# Altium schematic sheet Sheet1.SchDoc
size 431 x 279 mm; SheetNumber: 1; SheetTotal: 1; ENG_APP_DATE: --/--/--; DSN_APP_DATE: --/--/--; CHK_APP_DATE: --/--/--
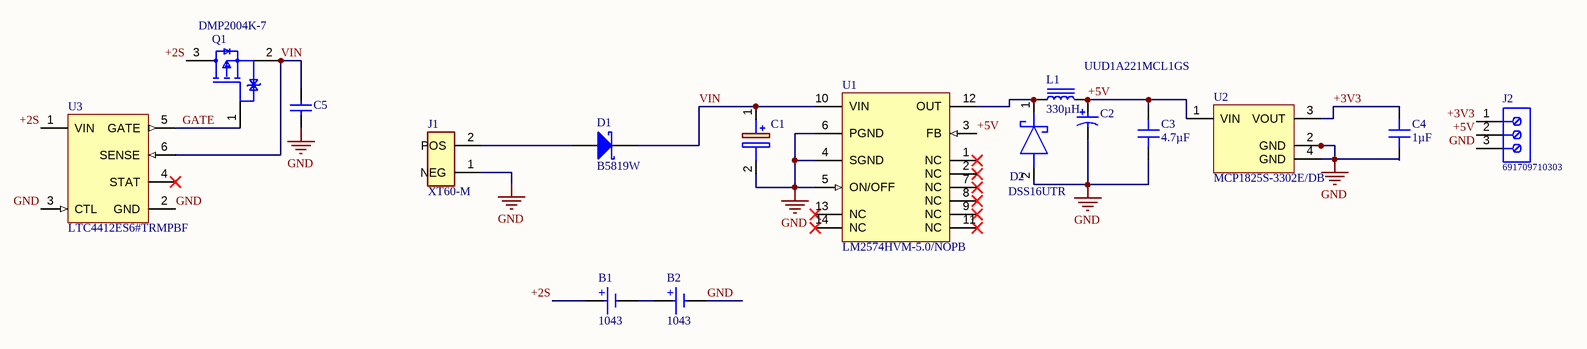
[diagram p0: Sheet1.SchDoc]

## Parts
B1  1043  [KEYSTONE 1043]
B2  1043  [KEYSTONE 1043]
C1  EMVH500ADA220MF80G  [CAPAE660X800N]  (value not drawn)
C2  UUD1A221MCL1GS  [NIC-CAPA2-6.3X7.7_V]
C3  4.7µF  [CAP 1206_3216 - 1.8MM]
C4  1µF  [CAP 1206_3216 - 1.8MM]
C5  C1206C105K5RACTU  [CAPC3216X110X50LL20T25]  (value not drawn)
D1  B5819W  [MCC-SOD123_V]
D2  DSS16UTR  [SODFL3618X110N]
J1  XT60-M  [AMASS_XT60-M]
J2  691709710303  [691709710303]
L1  330µH  [BOURNS SRR1280]
Q1  DMP2004K-7  [FP-SOT23-MFG]
U1  LM2574HVM-5.0/NOPB  [NPA0014B_L]
U2  MCP1825S-3302E/DB  [SOT-223-DB3_N]
U3  LTC4412ES6#TRMPBF  [LT-S6-6-TSOT-23_N]

## Nets
GND: B2.2(-) C1.2(-) C2.2 C3.1 C4.1 C5.1 D2.2(A) J1.1(NEG) J2.3 U1.4(SGND) U1.5(ON/OFF) U1.6(PGND) U2.2(GND) U2.4(GND) U3.2(GND) U3.3(CTL)
+2S: B1.1(+) Q1.3(D) U3.1(VIN)
+3V3: C4.2 J2.1 U2.3(VOUT)
+5V: C2.1 C3.2 J2.2 L1.2 U1.3(FB) U2.1(VIN)
GATE: Q1.1(G) U3.5(GATE)
VIN: C1.1(+) C5.2 D1.2(K) Q1.2(S) U1.10(VIN) U3.6(SENSE)
NetB1_2: B1.2(-) B2.1(+)
NetD1_1: D1.1(A) J1.2(POS)
NetD2_1: D2.1(K) L1.1 U1.12(OUT)

Not connected (* = marked no-connect by the designer): U1 1(NC)* 2(NC)* 7(NC)* 8(NC)* 9(NC)* 11(NC)* 13(NC)* 14(NC)*; U3 4(STAT)*

## Notes on the sheet
- DWG. NO.
- REV.
- SHT.
- THIS DOCUMENT AND THE DATA DISCLOSED HEREIN OR HEREWITH IS THE PROPERTY OF ALTIUM LIMITED AND MAY BE FREELY DISTRIBUTED IN WHOLE. NO RIGHTS ARE RESERVED OR EXPRESS OR IMPLIED WARANTEE GIVEN.
- REVISION
- DESCRIPTION
- DATE
- APPROVED
- ENG:
- APPROVALS
- PROJECT
- DSN:
- CHK:
- REFERENCE DOCUMENTS
- PROJECT REVISION:
- TITLE
- DOCUMENT REVISION:
- DESIGN ITEM:
- BOM:
- FAB DWG:
- PCB DWG:
- ASSY DWG:
- SCALE:
- SIZE
- B
- CAGE CODE
- FILE NAME
- DWG NO.
- SHEET
- OF
- REV

## Library data of the parts
B1 B2 = 1043: BATTERY HOLDER 18650 PC PIN; Manufacturer: Keystone Electronics; Battery Cell Size: 18650; Battery Type, Function: Cylindrical, Holder; Number of Cells: 1; Style: Holder (Open); Part Number: 1043; ComponentLink1Description: Datasheet; ComponentLink1URL: http://keyelco.com/userAssets/file/M65p27.pdf; ComponentLink2Description: DigiKey Link; ComponentLink2URL: http://digikey.com/product-detail/en/keystone-electronics/1043/36-1043-ND/2745669; Height Above Board: 0.585" (14.86mm); LastUpdated: 2/2/2020 9:19:56 AM; Lifecycle Status: Active; Minimum Order: 1; Mounting Type: PCB, Through Hole; Operating Temperature: -50°C ~ 145°C; Packaging: Unknown; PartId: 2; Part Status: Active; Price: 2.58; Series: -; Supplier 1: DigiKey; Supplier Part Number 1: 36-1043-ND; Termination Style: PC Pin
C1 = EMVH500ADA220MF80G: Capacitor Polarised; Manufacturer_Name: United Chemi-Con; Datasheet Link: https://eu.mouser.com/datasheet/2/420/MVHRA_e-2509159.pdf; Height: 8mm; Manufacturer_Part_Number: EMVH500ADA220MF80G; Mouser Part Number: 661-MVH50V220M; Mouser Price/Stock: https://www.mouser.co.uk/ProductDetail/United-Chemi-Con/EMVH500ADA220MF80G?qs=P6%252BCbgEIsoMIfZ3czqY2Bw%3D%3D; Arrow Part Number: EMVH500ADA220MF80G; Arrow Price/Stock: https://www.arrow.com/en/products/emvh500ada220mf80g/united-chemi-con
C2 = CMP-0687-00055-1: Aluminum Electrolytic Capacitor, UD Series, Low Impedance, 220 uF, 10 V, + / - 20%, -55 to 105 degC, Chip Type, 6.3 x 7.7 mm D x L, Pb-Free, Reel; Manufacturer: Nichicon; Packing: Dia382mm Reel; Tolerance Rated Capacitance: -20 to 20%; Impedance: 0.34 Ohm; Rated Ripple Current (at 100kHz): 280 mA; Rated Voltage: 10 V; Rated Capacitance: 220 uF; Endurance Time: 2000 h; RoHS: TRUE; ComponentLink1URL: http://www.nichicon.co.jp/; ComponentLink2Description: Datasheet; ComponentLink2URL: http://products.nichicon.co.jp/en/pdf/XJA043/e-ud.pdf; Mounting Technology: Surface Mount; PartNumber: UUD1A221MCL1GS; DatasheetVersion: 08/2012; ComponentLink3URL: http://products.nichicon.co.jp/en/pdf/XJA043/e-ud.pdf; ComponentLink3Description: Package Specification; PackageReference: CAPAE-D6.3H7.7; Diameter: 6.3 mm; PackageDescription: 2-Pin Surface Mount Device, Diameter 6.3 mm, Height 7.7 mm, Pitch 5.4 mm; Length: 7.7 mm; ComponentLink1Description: Manufacturer URL
C3 = CM316X5R475K25AT: CAP CER 4.7UF 25V X5R 1206; Manufacturer: Kyocera International Inc. Electronic Components; Tolerance: ±10%; Part Number: CM316X5R475K25AT; Value: 4.7µF; Applications: General Purpose; Capacitance: 4.7µF; ComponentLink1Description: Datasheet; ComponentLink1URL: https://global.kyocera.com/prdct/electro/product/pdf/cm_e.pdf; ComponentLink2Description: DigiKey Link; ComponentLink2URL: http://digikey.com/product-detail/en/kyocera-international-inc-electronic-components/CM316X5R475K25AT/1253-2080-1-ND/10197176; Device Package: 1206 (3216 Metric); LastUpdated: 9/2/2020 1:05:31 AM; Lifecycle Status: Active; Minimum Order: 1; Mounting Type: Surface Mount, MLCC; Operating Temperature: -55°C ~ 85°C; Package / Case: 1206 (3216 Metric); Packaging: TapeAndReel; PartId: 21915; Part Status: Active; Price: 0.09; Series: CM; Size / Dimension: 0.126" L x 0.063" W (3.20mm x 1.60mm); Supplier 1: DigiKey; Supplier Part Number 1: 1253-2080-1-ND; Temperature Coefficient: X5R; Thickness (Max): 0.069" (1.75mm); Voltage - Rated: 25V
C4 = CM316X5R475K25AT: CAP CER 4.7UF 25V X5R 1206; Manufacturer: Kyocera International Inc. Electronic Components; Capacitance: 4.7µF; Tolerance: ±10%; Part Number: CM316X5R475K25AT; Value: 1µF; Applications: General Purpose; ComponentLink1Description: Datasheet; ComponentLink1URL: https://global.kyocera.com/prdct/electro/product/pdf/cm_e.pdf; ComponentLink2Description: DigiKey Link; ComponentLink2URL: http://digikey.com/product-detail/en/kyocera-international-inc-electronic-components/CM316X5R475K25AT/1253-2080-1-ND/10197176; Device Package: 1206 (3216 Metric); LastUpdated: 9/2/2020 1:05:31 AM; Lifecycle Status: Active; Minimum Order: 1; Mounting Type: Surface Mount, MLCC; Operating Temperature: -55°C ~ 85°C; Package / Case: 1206 (3216 Metric); Packaging: TapeAndReel; PartId: 21915; Part Status: Active; Price: 0.09; Series: CM; Size / Dimension: 0.126" L x 0.063" W (3.20mm x 1.60mm); Supplier 1: DigiKey; Supplier Part Number 1: 1253-2080-1-ND; Temperature Coefficient: X5R; Thickness (Max): 0.069" (1.75mm); Voltage - Rated: 25V
C5 = CMP-2000-06011-1: Chip Capacitor, 1 uF, +/- 10%, 50 V, -55 to 125 degC, 1206 (3216 Metric), RoHS, Tape and Reel; Manufacturer: Kemet; Case Height: 1mm; Dielectric: X7R; Voltage Rating: 50V; Capacitance: 1uF; Temperature Coefficient / Code: +/-15%; Case Length: 3.2mm; Case Width: 1.6mm; Type: SMDMLCCX7R6.3-250VDCCommericalGrade; Class: Class1; Capacitance - nF: 1000nF; Datasheet URL: http://www.kemet.com/docfinder?Partnumber=C1206C105K5RACTU; Product Category: MultilayerCeramicCapacitorsMLCC-SMD/SMT; Termination Style: SMD/SMT; Dimensions: 1.6mmWx3.2mmLx1mmH; Voltage Rating DC: 50V; Datasheet Version: 02/2016; Packaging: Reel; Brand: Kemet; RoHS: Details; Minimum Operating Temperature: -55C; Operating Temperature Range: -55Cto+125C; Package Reference: 1206; Manufacturer URL: http://www.kemet.com/; Product: GeneralTypeMLCCs; Tolerance: 10%; Package Description: 2-Pin Surface Mount Device, Body 3.2 x 1.6 mm; Mounting Technology: SurfaceMount; Case Code - mm: 3216; Maximum Operating Temperature: +125C; Series: C1206C; Factory Pack Quantity: 2500; Package / Case: 1206(3216metric); Case Code - in: 1206
D1 = CMP-004-00005-2: Schottky Barrier Rectifier, 40 V, 1 A, -65 to 125 degC, 2-Pin SOD123, RoHS, Tape and Reel; Manufacturer: Micro Commercial Components; Datasheet Version: Rev. B, 01/2013; RoHS Compliant: Unknown; Manufacturer URL: http://www.mccsemi.com/; Package URL: http://www.mccsemi.com/up_pdf/1N4448W(SOD-123).pdf; Case/Package: SOD123; Mounting Technology: SM; Datasheet URL: http://www.mccsemi.com/up_pdf/B5817W-B5819W(SOD-123).pdf; Package Description: 2-Pin Small Outline Diode, Body 2.7 x 1.6 mm, Height 1.35 mm; Package Reference: SOD123
D2 = DSS16UTR: Schottky Diode; Manufacturer_Name: SMC Diode Solutions; Datasheet Link: http://www.smc-diodes.com/propdf/DSS12U%20THRU%20DSS125U%20N1873%20REV.A.pdf; Height: 1.1mm; Manufacturer_Part_Number: DSS16UTR
J1 = XT60-M: Plug; DC supply; XT60; male; PIN: 2; for cable; soldered; 30A; 500V; MF: AMASS; MP: XT60-M; Price: None; Package: Package Analog Devices; Value: *; Availability: Unavailable; SnapEDA_Link: https://www.snapeda.com/parts/XT60-M/AMASS/view-part/2883912/?ref=snap
J2 = CMP-1502-03336-1: Serie 7097 - 5.00 mm Horizontal Entry SMT with Pressure Clamp WR-TBL, 3 pin; Manufacturer: Wurth Elektronik; Pitch: 5.00mm; Pin Number: 3; Mounting Technology: SMT; Publisher: WurthElektronik; Package Reference: 691709710303; Packaging: TapeandReelwithCap; Part Number: 691709710303; Operating Temperature: -45to130degC; Datasheet URL: http://katalog.we-online.de/em/datasheet/6917097103xx.pdf; Manufacturer URL: http://www.we-online.de
L1 = SRR1280-331K: FIXED IND 330UH 1.1A 600MOHM SMD; Manufacturer: Bourns Inc.; Current - Saturation: 1.4A; DC Resistance (DCR): 600mOhm Max; Frequency - Self Resonant: 2.9MHz; Inductance Frequency - Test: 100kHz; Material - Core: Ferrite; Q @ Freq: 18 @ 796kHz; Shielding: Shielded; Tolerance: ±10%; Type: Wirewound; Part Number: SRR1280-331K; ComponentLink1Description: Datasheet; ComponentLink1URL: https://www.bourns.com/docs/Product-Datasheets/SRR1280.pdf; ComponentLink2Description: DigiKey Link; ComponentLink2URL: http://digikey.com/product-detail/en/bourns-inc/SRR1280-331K/SRR1280-331KLCT-ND/2127441; Current Rating (Amps): 1.1A; Device Package: Nonstandard; Height - Seated (Max): 0.315" (8.00mm); Inductance: 330µH; LastUpdated: 9/2/2020 1:22:09 AM; Lifecycle Status: Active; Minimum Order: 1; Mounting Type: Surface Mount; Operating Temperature: -40°C ~ 125°C; Package / Case: Nonstandard; Packaging: TapeAndReel; PartId: 35; Part Status: Active; Price: 0.65; Series: SRR1280; Size / Dimension: 0.492" L x 0.492" W (12.50mm x 12.50mm); Supplier 1: DigiKey; Supplier Part Number 1: SRR1280-331KLCT-ND; Value: 330µH
Q1 = CMP-12801-000029-1: MOSFET P-CH 20V 600MA SOT23-3; Manufacturer: Diodes Inc.; Max Junction Temp: +150°C; Turn On Delay Time: 8.5ns; Gate To Source Voltage: 8V; Input Capacitace At Vds: 175pF @ -16V; Rthja Max: 227°C/W; Drain To Source Resistance: 1.1Ω; Turn Off Delay Time: 20.2ns; Standoff Height: 0.013mm; Drain To Source Breakdown Voltage: -20V; Number Of P Channels: 1; Power Dissipation: 550mW; Pulse Drain Current: -1.9A; Depletion Mode: False; Max Forward Diode Voltage: -1.2V; Threshold Vgs Min: -0.5V; Threshold Vgs Max: -1V; Continuous Drain Current: -600mA; Manufacturer Part Number: DMP2004K-7; Height: 1.1mm; ComponentLink2Description: Datasheet; ComponentLink2URL: https://www.diodes.com/assets/Datasheets/ds30933.pdf; Package: SOT23; Footprint Url: https://www.diodes.com/assets/Package-Files/SOT23.pdf; Lead Free: Yes; Octopart: https://octopart.com/dmp2004k-7-diodes+inc.-7151877; Digikey Description: MOSFET P-CH 20V 600MA SOT23-3; Device Class L1: Discrete Semiconductors; Drain To Source Voltage: -20V; Mouser Description: MOSFET P-Channel; Number Of Channels: 1; Device Class L3: MOSFETs; Temperature: -55°C to +150°C; Category: Trans; Device Class L2: Transistors; Automotive: No; Temperature Range High: +150°C; RoHS: TRUE; Temperature Range Low: -55°C
U1 = CMP-0069-00789-3: SIMPLE SWITCHER® 0.5A Step-Down Voltage Regulator, 14-pin Wide SOIC, Pb-Free; Manufacturer: Texas Instruments; PackageTopMarking: NSUZXYTTE#*LM2574HVM*-5.0 P+; PowerWise: N; PackageDescription: Molded Package, S.O., .300in Wide, 14 Lead; ComponentLink1Description: Datasheet URL; Code_IPC: SOIC127P1030-14; CompType: Switcher; ComponentLink1URL: http://www.ti.com/general/docs/lit/getliterature.tsp?genericPartNumber=LM2574HV&fileType=pdf; Code_JEDEC: MS-013-AF; PackageReference: NPA0014B; RoHS: Y; PinCount: 14
U2 = CMP-0136-00458-1: 500 mA, Low Voltage, Low Quiescent Current LDO Regulator, 3-Pin SOT-223, Extended Temperature; PackageReference: SOT-223-DB3; PackageDescription: 3-Lead Plastic Small Outline Transistor (DB) [SOT-223]; PackageVersion: revBB, Aug-2009; DatasheetVersion: revB, Feb-2008
U3 = CMP-0479-00425-1: Low Loss PowerPath(TM) Controller, 2.5 to 28 V Vin, 6-pin SOT23 (S6-6), -40 to 85 degC, Pb-Free, Mini Tape and Reel; Manufacturer: Linear Technology; Ideal Diode: Single, External, P-Channel; ComponentLink2URL: http://cds.linear.com/docs/en/datasheet/4412fa.pdf; Mounting Technology: Surface Mount; PackageReference: S6-6; PackageDescription: 6-Pin Plastic TSOT-23, Body 2.9 x 1.63 mm, Pitch 0.95 mm; ComponentLink3Description: Package Specification; Packing: Mini Tape and Reel; RoHS: TRUE; ComponentLink3URL: http://cds.linear.com/docs/en/packaging/SOT_6_05-08-1636.pdf; PartNumber: LTC4412ES6#TRMPBF; ComponentLink1Description: Manufacturer URL; ComponentLink1URL: http://www.linear.com/; ComponentLink2Description: Datasheet; PackageVersion: Jun-10; Code_JEDEC: MO-193